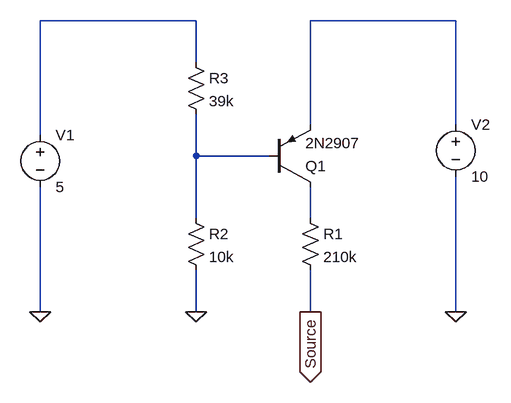
[diagram p0: schematic CurrentSource.asc]
CurrentSource.asc, the LTspice schematic file:
Version 4
SHEET 1 880 680
WIRE 80 -144 -160 -144
WIRE 480 -144 256 -144
WIRE 80 -80 80 -144
WIRE 256 16 256 -144
WIRE 480 16 480 -144
WIRE -160 32 -160 -144
WIRE 80 64 80 0
WIRE 192 64 80 64
WIRE 80 160 80 64
WIRE 256 160 256 112
WIRE -160 304 -160 112
WIRE 80 304 80 240
WIRE 256 304 256 240
WIRE 480 304 480 96
FLAG -160 304 0
FLAG 80 304 0
FLAG 480 304 0
FLAG 256 304 Source
IOPIN 256 304 Out
SYMBOL res 240 144 R0
SYMATTR InstName R1
SYMATTR Value 210k
SYMBOL res 64 144 R0
SYMATTR InstName R2
SYMATTR Value 10k
SYMBOL res 64 -96 R0
SYMATTR InstName R3
SYMATTR Value 39k
SYMBOL voltage -160 16 R0
WINDOW 123 0 0 Left 0
WINDOW 39 0 0 Left 0
SYMATTR InstName V1
SYMATTR Value 5
SYMBOL voltage 480 0 R0
WINDOW 123 0 0 Left 0
WINDOW 39 0 0 Left 0
SYMATTR InstName V2
SYMATTR Value 10
SYMBOL pnp 192 112 M180
SYMATTR InstName Q1
SYMATTR Value 2N2907

The netlist it stands for:
* CurrentSource.asc
R1 N004 Source 210k
R2 N003 0 10k
R3 N001 N003 39k
V1 N001 0 5
V2 N002 0 10
Q1 N004 N003 N002 0 2N2907
.model NPN NPN
.model PNP PNP
.lib standard.bjt
.backanno
.end